# Altium project TennisButler.PrjPcb (part 1 of 2)
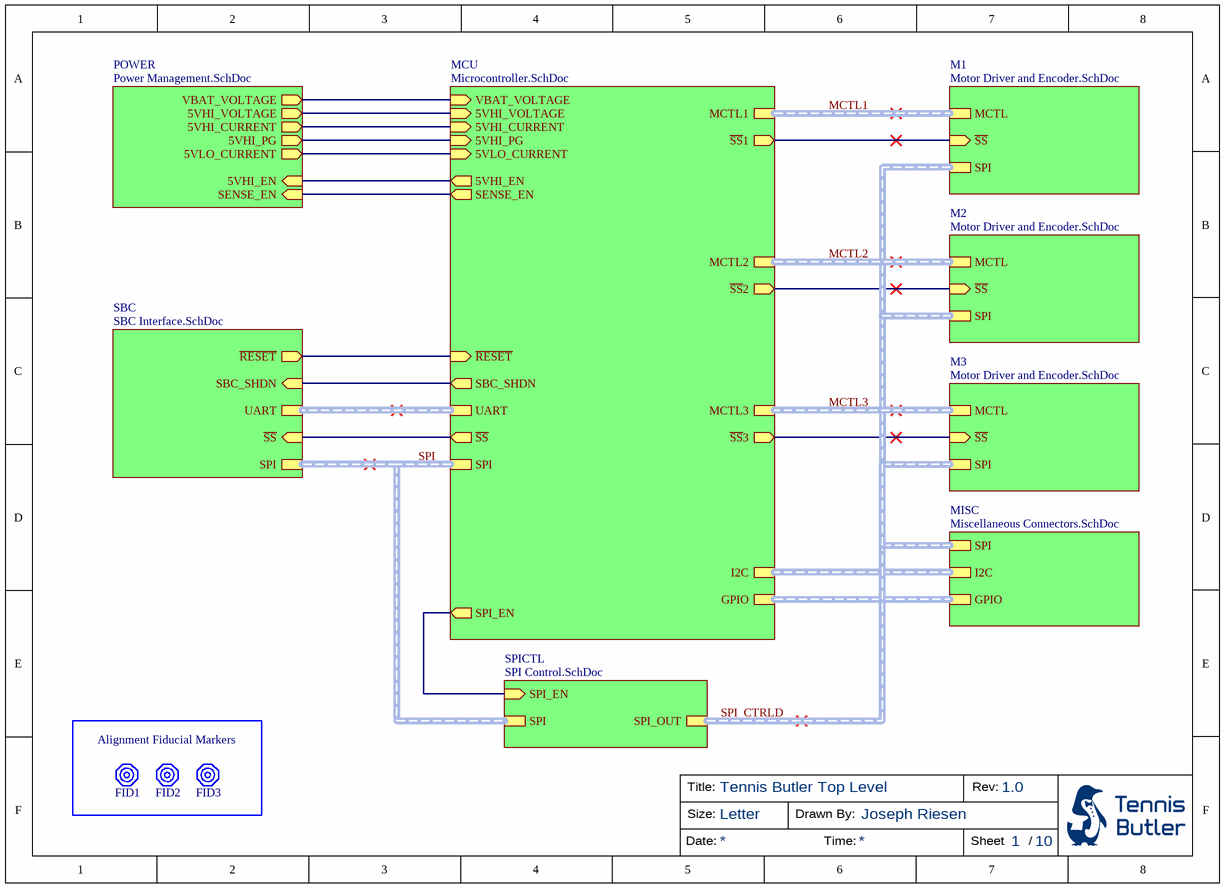
[diagram p0: Tennis Butler V1.0.SchDoc]
10 sheets, 98 parts. Net scope: hierarchical (ports join the sheet entries above them; power ports are global).
Board file: TennisButler PCB.PcbDoc
Sheets:
  Tennis Butler V1.0.SchDoc
    M1 = Motor Driver and Encoder.SchDoc
    POWER = Power Management.SchDoc
      HI = High-Current Power Supply.SchDoc
      LO = Low-Current Power Supply.SchDoc
    MCU = Microcontroller.SchDoc
      MCU_SUPPORT = Microcontroller Support.SchDoc
    M2 = Motor Driver and Encoder.SchDoc
    M3 = Motor Driver and Encoder.SchDoc
    SBC = SBC Interface.SchDoc
    MISC = Miscellaneous Connectors.SchDoc
    SPICTL = SPI Control.SchDoc

## Sheet Tennis Butler V1.0.SchDoc: Tennis Butler Top Level
size 228 x 165 mm; DrawnBy: Joseph Riesen; DocumentNumber: 1; Revision: 1.0; SheetNumber: 1; SheetTotal: 10

### Parts
FID1  Fiducial, Global  [Fiducial, Global]  (value not drawn)  (no BOM)
FID2  Fiducial, Global  [Fiducial, Global]  (value not drawn)  (no BOM)
FID3  Fiducial, Global  [Fiducial, Global]  (value not drawn)  (no BOM)

### Blocks framed on the sheet
Alignment Fiducial Markers: FID1-FID3

### Sub-sheets
M1 = Motor Driver and Encoder.SchDoc: ~{SS} (in), SPI (harness SPI), MCTL (harness Motor Control)
M2 = Motor Driver and Encoder.SchDoc: ~{SS} (in), SPI (harness SPI), MCTL (harness Motor Control)
M3 = Motor Driver and Encoder.SchDoc: ~{SS} (in), SPI (harness SPI), MCTL (harness Motor Control)
MCU = Microcontroller.SchDoc: SPI (harness SPI), UART (harness UART), ~{RESET} (in), MCTL3 (harness Motor Control), MCTL2 (harness Motor Control), MCTL1 (harness Motor Control), ~{SS}3 (out), ~{SS}2 (out), ~{SS}1 (out), VBAT_VOLTAGE (in), 5VLO_CURRENT (in), 5VHI_CURRENT (in), SENSE_EN (out), 5VHI_EN (out), 5VHI_PG (in), I2C (harness I2C), SBC_SHDN (out), GPIO (harness GPIO), ~{SS} (out), SPI_EN (out), 5VHI_VOLTAGE (in)
MISC = Miscellaneous Connectors.SchDoc: SPI (harness SPI), I2C (harness I2C), GPIO (harness GPIO)
POWER = Power Management.SchDoc: 5VHI_EN (in), SENSE_EN (in), VBAT_VOLTAGE (out), 5VHI_PG (out), 5VLO_CURRENT (out), 5VHI_CURRENT (out), 5VHI_VOLTAGE (out)
SBC = SBC Interface.SchDoc: UART (harness UART), ~{RESET} (out), ~{SS} (in), SPI (harness SPI), SBC_SHDN (in)
SPICTL = SPI Control.SchDoc: SPI_EN (in), SPI_OUT (harness SPI), SPI (harness SPI)

### Nets
5VHI_CURRENT: sheet POWER/5VHI_CURRENT, sheet MCU/5VHI_CURRENT
5VHI_EN: sheet POWER/5VHI_EN, sheet MCU/5VHI_EN
5VHI_PG: sheet POWER/5VHI_PG, sheet MCU/5VHI_PG
5VHI_VOLTAGE: sheet POWER/5VHI_VOLTAGE, sheet MCU/5VHI_VOLTAGE
5VLO_CURRENT: sheet POWER/5VLO_CURRENT, sheet MCU/5VLO_CURRENT
~{OE}: sheet MCU/SPI_EN, sheet SPICTL/SPI_EN
~{RESET}: sheet MCU/~{RESET}, sheet SBC/~{RESET}
~{SS}: sheet MCU/~{SS}, sheet SBC/~{SS}
~{SS}1: sheet M1/~{SS}, sheet MCU/~{SS}1
~{SS}2: sheet MCU/~{SS}2, sheet M2/~{SS}
~{SS}3: sheet MCU/~{SS}3, sheet M3/~{SS}
SBC_SHDN: sheet MCU/SBC_SHDN, sheet SBC/SBC_SHDN
SENSE_EN: sheet POWER/SENSE_EN, sheet MCU/SENSE_EN
VBAT_VOLTAGE: sheet POWER/VBAT_VOLTAGE, sheet MCU/VBAT_VOLTAGE

### Buses and harness runs
harness MCTL1 = sheet M1/MCTL = sheet MCU/MCTL1
harness MCTL2 = sheet M2/MCTL = sheet MCU/MCTL2
harness MCTL3 = sheet M3/MCTL = sheet MCU/MCTL3
harness sheet MCU/GPIO = sheet MISC/GPIO
harness sheet MCU/I2C = sheet MISC/I2C
harness sheet MCU/UART = sheet SBC/UART
harness SPI = sheet MCU/SPI = sheet SBC/SPI = sheet SPICTL/SPI
harness SPI_CTRLD = sheet M1/SPI = sheet M2/SPI = sheet M3/SPI = sheet MISC/SPI = sheet SPICTL/SPI_OUT

### Notes on the sheet
- Title:
- Size:
- Letter
- Drawn By:
- Rev:
- Date:
- Time:
- Sheet
- /

## Sheet Motor Driver and Encoder.SchDoc: Motor Driver and Encoder Counter
size 228 x 165 mm; DrawnBy: Joseph Riesen; DocumentNumber: 7; Revision: 1.0; SheetNumber: 7; SheetTotal: 10
Used 3 times, as channels M1, M2, M3. Parts and nets are listed once, with the designators drawn on the sheet.
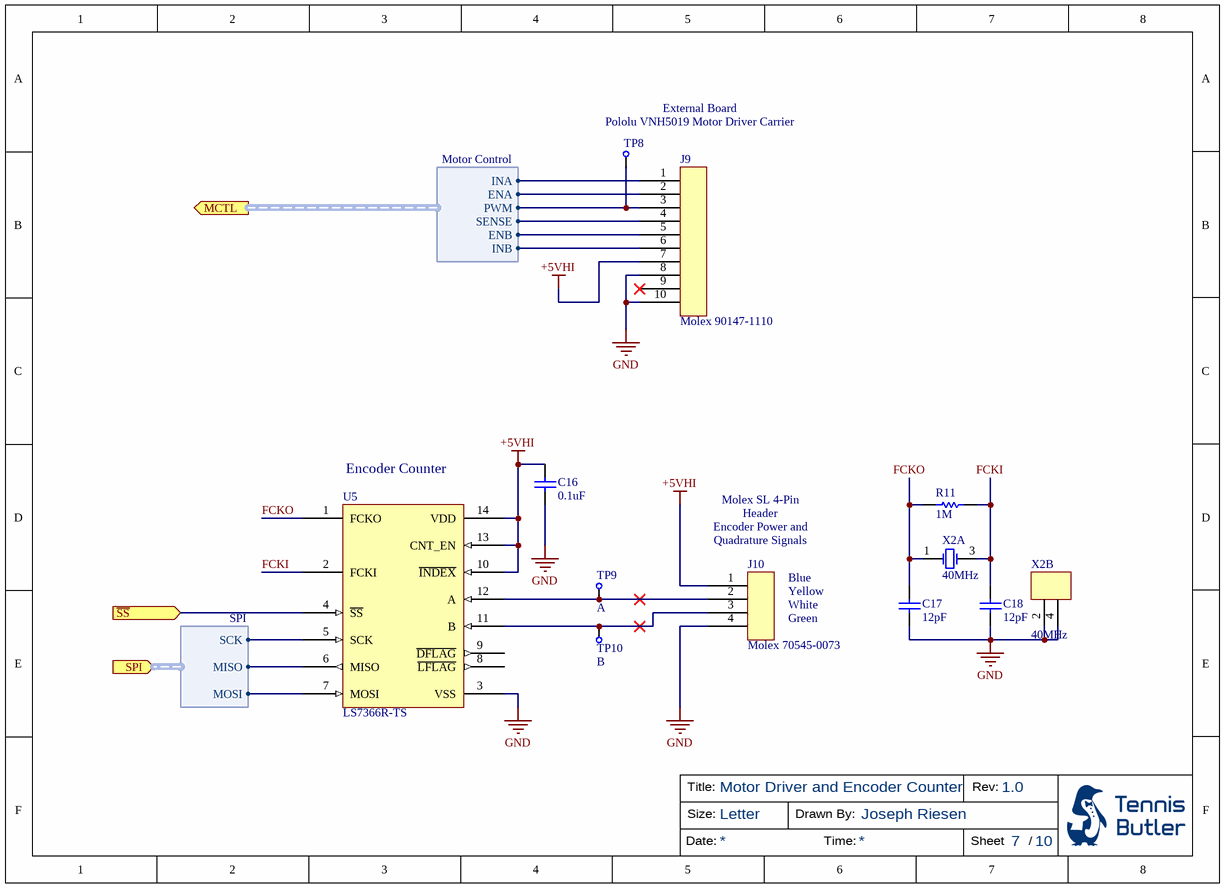
[diagram p1: Motor Driver and Encoder.SchDoc]

### Parts
C16  0.1uF  [CAPC0805(2012)100_M]
C17  12pF  [CAPC1608X87X35ML15T15]
C18  12pF  [CAPC1608X87X35ML15T15]
J9  Molex 90147-1110  [Molex 90147-1110]
J10  Molex 70545-0073  [Molex 70545-0073]
R11  1M  [RESC2013X70X40NL20T20]
TP8  PWM  [Test Point]  (value not drawn)  (no BOM)
TP9  A  [Test Point]  (no BOM)
TP10  B  [Test Point]  (no BOM)
U5  LS7366R-TS  [TSOP65P640X110-14M]
X2  40MHz  [DFN220P320X80-4M]  (parts A,B of 2)

### Ports
MCTL (out, harness Motor Control), SPI (in, harness SPI), ~{SS} (in)

### Harnesses
SPI: MISO, MOSI, SCK
Motor Control: ENA, ENB, INA, INB, PWM, SENSE

### Nets
+5VHI: C16.2 J9.7 J10.1 U5.10(~{INDEX}) U5.13(CNT_EN) U5.14(VDD)
GND: C16.1 C17.1 C18.1 J9.8 J9.10 J10.4 U5.3(VSS) X2.2(GND) X2.4(GND)
FCKI: C18.2 R11.1 U5.2(FCKI) X2.3(X2)
FCKO: C17.2 R11.2 U5.1(FCKO) X2.1(X1)
~{SS}: U5.4(~{SS}) ; port ~{SS}
NetJ9_1: J9.1 ; port MCTL.INA
NetJ9_2: J9.2 ; port MCTL.ENA
NetJ9_3: J9.3 TP8.1 ; port MCTL.PWM
NetJ9_4: J9.4 ; port MCTL.SENSE
NetJ9_5: J9.5 ; port MCTL.ENB
NetJ9_6: J9.6 ; port MCTL.INB
NetJ10_2: J10.2 TP9.1 U5.12(A)
NetJ10_3: J10.3 TP10.1 U5.11(B)
NetU5_5: U5.5(SCK) ; port SPI.SCK
NetU5_6: U5.6(MISO) ; port SPI.MISO
NetU5_7: U5.7(MOSI) ; port SPI.MOSI

Not connected (* = marked no-connect by the designer): J9 9*; U5 8(~{LFLAG}) 9(~{DFLAG})

### Channels
M1: designators end in _M1; ports ~{SS}=~{SS}1
M2: designators end in _M2; ports ~{SS}=~{SS}2
M3: designators end in _M3; ports ~{SS}=~{SS}3

### Notes on the sheet
- (near TP8) External Board
  Pololu VNH5019 Motor Driver Carrier
- (near U5) Encoder Counter
- (near J10) Molex SL 4-Pin Header
  Encoder Power and Quadrature Signals
- (near J10) Blue
- (near J10) Yellow
- (near J10) White
- (near J10) Green
- Title:
- Size:
- Letter
- Drawn By:
- Rev:
- Date:
- Time:
- Sheet
- /

### Library data of the parts
C16 = CMP-1036-04391-1: CAP 100nF 6.3V ±10% 0805 (2012 Metric) Thickness 1mm SMD; Case-EIA: 0805; Case-Metric: 2012; Tolerance: Â±10%; Rated Voltage: 6.3 V; Technology: SMT; Value: 100nF; Max Thickness: 1 mm
C17 C18 = CMP-2006-03475-1: Manufacturer: Kemet; Part Number: C0603C120C5GACTU
J9 = Molex 90147-1110 C-Grid 10-Pin Header: C-Grid® PC Board Connector, Single Row, Vertical, 10 Circuits, Tin (Sn) Plating; Number of Positions: 10; Current Rating: 3A; Voltage Rating: 350V; Pitch: 2.54mm; Glow Wire Compliant: Non-compliant; Supplier 1: Digikey; Manufacturer: Molex; Manufacturer Part Number: 90147-1110; Stock 1: 2940; Pricing 1: 1 = 2.53000, 10 = 2.29800, 25 = 2.15760, 50 = 2.06380, 100 = 1.97000, 250 = 1.78240, 500 = 1.64168, 1760 = 1.36024, 3520 = 1.31334 (USD); RoHS 1: Yes; Mount: Through Hole; Contact Plating: Tin; Contact Material: Bronze; Housing Material: Polyester; Material: Bronze; Min Operating Temperature: -55°C; Max Operating Temperature: 125°C; Number of Rows: 1; Packaging: Rail/Tube; Number of Contacts: 10; Termination: Solder; Orientation: Vertical; Package Quantity: 1760; Number of Circuits: 10; Radiation Hardening: No; Flammability Rating: UL94 V-0; ComponentLink1URL: https://datasheet.ciiva.com/16732/0901471110-pcb-receptacles-16732368.pdf?src-supplier=Avnet+Europe; ComponentLink1Description: Datasheet 1 (Avnet Europe); ComponentLink2URL: https://datasheet.ciiva.com/30193/276430901471110-pcb-receptacles-30193986.pdf?src-supplier=Onlinecomponents.com; ComponentLink2Description: Datasheet 3 (Mouser); ComponentLink3URL: https://datasheet.ciiva.com/5158/0901471110-pcb-receptacles-176767-5158986.pdf?src-supplier=Mouser; ComponentLink3Description: Datasheet 4 (Avnet); ComponentLink4URL: https://datasheet.ciiva.com/10082/0901471110-pcb-receptacles-10082332.pdf?src-supplier=Avnet; ComponentLink4Description: Datasheet 2 (Onlinecomponents.com); Supplier Part Number 1: WM3630-ND
J10 = Molex 70545-0073 SL 4-Pin Header: CONN HEADER VERT 4POS 2.54MM, PEG; Contact Resistance: 30mR; Number of Positions: 4; Current Rating: 3A; Voltage Rating: 250V; Insulation Resistance: 1GR; Glow Wire Compliant: Non-compliant; ComponentLink1Description: Drawing; ComponentLink1URL: https://www.molex.com/pdm_docs/sd/705450073_sd.pdf; Supplier 1: Digikey; Manufacturer: Molex; Manufacturer Part Number: 70545-0073; Stock 1: 705; Pricing 1: 1 = 1.55000, 10 = 1.41000, 100 = 1.20860, 500 = 1.00712, 1440 = 0.86325, 5760 = 0.76541, 10080 = 0.74815 (USD); RoHS 1: Yes; Mount: Through Hole; Contact Plating: Gold; Contact Material: Bronze; Housing Material: Polycyclohexylenedimethylene; Color: Black; Material: Brass; Min Operating Temperature: -40°C; Max Operating Temperature: 105°C; Number of Rows: 1; Packaging: Rail/Tube; Package Quantity: 1440; Termination: Through Hole; Orientation: Vertical; Number of Contacts: 4; Voltage Rating (DC): 250V; Number of Circuits: 4; Pitch: 2.54mm; Flammability Rating: UL94 V-0; ELV: Compliant; Supplier Part Number 1: WM12791-ND
R11 = CMP-1665-00012-4: Chip Resistor, 1000 KOhm, +/- 1%, 0.125 W, -55 to 155 degC, 0805 (2012 Metric), RoHS, Tape and Reel; Manufacturer: Panasonic; Voltage Rating: 150 V; ComponentLink2URL: http://industrial.panasonic.com/cdbs/www-data/pdf/RDA0000/AOA0000C86.pdf; PackageReference: 0805; Min Operating Temperature: -55 degC; RoHSCompliant: true; Package Quantity: 5000; ComponentLink1URL: http://www.panasonic.com/; Pins: 2; Height: 0.6 mm; Packaging: Tape and Reel; ComponentLink2Description: Datasheet; ComponentLink1Description: Manufacturer URL; Mounting Technology: Surface Mount; REACH SVHC: Yes; Mount: Surface Mount; PackageDescription: 2-Pin Surface Mount Device, Body 2 x 1.25 mm; DatasheetVersion: 04/2015; Max Operating Temperature: 155 degC; Length: 2 mm
TP8-TP10 = Test Point
U5 = LS7366R-TS: 32-Bit Quadrature Clock Counter with Serial Interface; Manufacturer: LSI/CSI; Case/Package: TSSOP; Manufacturer Part Number: LS7366R-TS; ComponentLink1Description: Datasheet; ComponentLink1URL: https://lsicsi.com/datasheets/LS7366R.pdf; Number of Pins: 14; Packaging: Tray; Supplier 1: LSI/CSI; Supplier Part Number 1: LS7366R-TS; Stock 1: 10000; Lead Free: Lead Free; RoHS: Yes; Pricing 1: 1 = 3.96000, 25 = 3.16000, 100 = 2.51000, 500 = 2.01000, 1000 = 1.61000, 5000 = 1.37000, 10000 = 1.17000 (USD); ComponentLink2Description: Manufacturer's Website; ComponentLink2URL: https://lsicsi.com/#/products/Incremental-Encoder-Interface/LS7366R_LS7366R-S_LS7366R-TS
X2 = 603-40-48: CRYSTAL 40MHZ 12PF SMD; Manufacturer: Fox Electronics; Supplier 1: Digi-Key; Manufacturer Part Number: 603-40-48; Stock 1: 3916; Pricing 1: 1 = 0.840000, 10 = 0.744000, 50 = 0.695400, 100 = 0.614500, 500 = 0.582120, 1000 = 0.485100 (USD); RoHS 1: No; ComponentLink1URL: https://www.foxonline.com/pdfs/603-40-48.pdf?src-supplier=Digi-Key; ComponentLink1Description: Datasheet; Supplier Part Number 1: 631-1480-1-ND

## Sheet Power Management.SchDoc: Power Management
size 228 x 165 mm; DrawnBy: Joseph Riesen; DocumentNumber: 4; Revision: 1.0; SheetNumber: 4; SheetTotal: 10
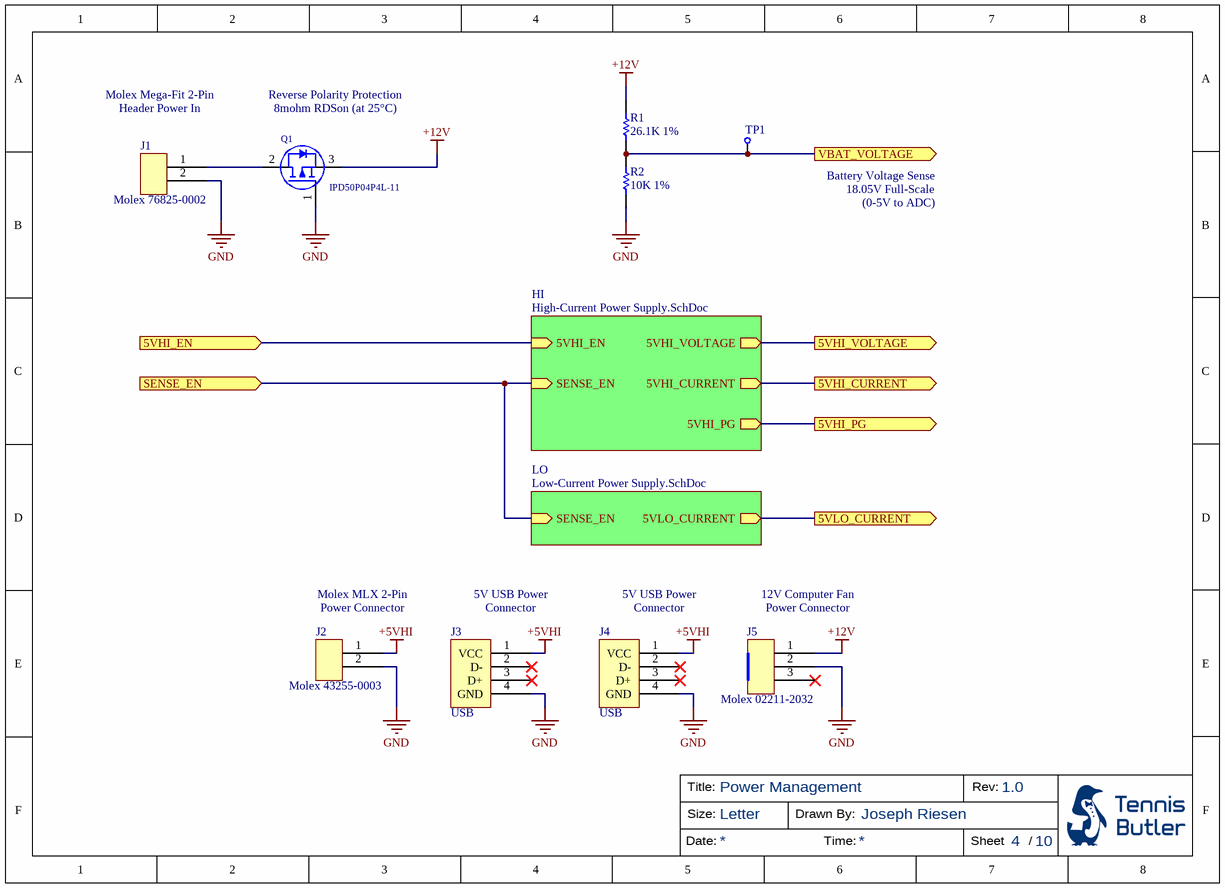
[diagram p2: Power Management.SchDoc]

### Parts
J1  Molex 76825-0002  [MOLEX 76825-0002]
J2  Molex 43255-0003  [Molex 43255-0003]
J3  USB  [Molex 105057-0001]
J4  USB  [Molex 105057-0001]
J5  Molex 02211-2032  [Molex 02211-2032]
Q1  IPD50P04P4L-11  [DPAK228P1000X235-3M]
R1  26.1K 1%  [RESC0805(2012)_M]
R2  10K 1%  [RESC2013X70X40ML20T20]
TP1  VBAT VOLTAGE  [Test Point]  (value not drawn)  (no BOM)

### Sub-sheets
HI = High-Current Power Supply.SchDoc: 5VHI_EN (in), 5VHI_CURRENT (out), SENSE_EN (in), 5VHI_PG (out), 5VHI_VOLTAGE (out)
LO = Low-Current Power Supply.SchDoc: 5VLO_CURRENT (out), SENSE_EN (in)

### Ports
5VHI_CURRENT (out), 5VHI_EN (in), 5VHI_PG (out), 5VHI_VOLTAGE (out), 5VLO_CURRENT (out), SENSE_EN (in), VBAT_VOLTAGE (out)

### Nets
+5VHI: J2.1 J3.1(VCC) J4.1(VCC)
+12V: J5.1 Q1.3 R1.2
GND: J1.2 J2.2 J3.4(GND) J4.4(GND) J5.2 Q1.1 R2.1
5VHI_CURRENT: port 5VHI_CURRENT, sheet HI/5VHI_CURRENT
5VHI_EN: port 5VHI_EN, sheet HI/5VHI_EN
5VHI_PG: port 5VHI_PG, sheet HI/5VHI_PG
5VHI_VOLTAGE: port 5VHI_VOLTAGE, sheet HI/5VHI_VOLTAGE
5VLO_CURRENT: port 5VLO_CURRENT, sheet LO/5VLO_CURRENT
SENSE_EN: port SENSE_EN, sheet HI/SENSE_EN, sheet LO/SENSE_EN
VBAT_VOLTAGE: R1.1 R2.2 TP1.1 ; port VBAT_VOLTAGE
NetJ1_1: J1.1 Q1.2

Not connected (* = marked no-connect by the designer): J3 2(D-)* 3(D+)* 5(GND) 6(GND) 7(GND); J4 2(D-)* 3(D+)* 5(GND) 6(GND) 7(GND); J5 3*

### Notes on the sheet
- (near J1) Molex Mega-Fit 2-Pin
  Header Power In
- (near Q1) Reverse Polarity Protection
  8mohm RDSon (at 25°C)
- Battery Voltage Sense
  18.05V Full-Scale
  (0-5V to ADC)
- (near J2) Molex MLX 2-Pin Power Connector
- (near J3) 5V USB Power Connector
- (near J4) 5V USB Power Connector
- (near J5) 12V Computer Fan Power Connector
- Title:
- Size:
- Letter
- Drawn By:
- Rev:
- Date:
- Time:
- Sheet
- /

### Library data of the parts
J1 = Molex 76825-0002: CONN HEADER R/A 2POS; Number of Circuits: 2; Gender: Male; Pitch: 5.7mm; Supplier 1: Digi-Key; Manufacturer: Molex; Manufacturer Part Number: 76825-0002; Stock 1: 2541; Pricing 1: 1 = 1.13000, 10 = 0.99300, 25 = 0.93440, 50 = 0.89560, 100 = 0.85670, 250 = 0.77880, 500 = 0.70092, 2016 = 0.58410, 4032 = 0.56463 (USD); RoHS: Yes; Color: Black; Contact Plating: Tin; Contact Material: Copper; Termination: Through Hole; Number of Rows: 2; Orientation: Right Angle; Number of Contacts: 2; REACH SVHC: Unknown; ComponentLink1URL: http://www.farnell.com/datasheets/2216551.pdf?src-supplier=Farnell; ComponentLink1Description: Datasheet 1 (Farnell); ComponentLink2URL: http://www.alliedelec.com/images/products/datasheets/bm/BrandonData/70717238.pdf?src-supplier=Allied+Electronics; ComponentLink2Description: Datasheet 2 (Allied Electronics); ComponentLink3URL: https://www.molex.com/pdm_docs/sd/768250002_sd.pdf?src-supplier=Digi-Key; ComponentLink3Description: Datasheet 3 (Digi-Key); ComponentLink4URL: http://www.farnell.com/datasheets/2001779.pdf?src-supplier=Element14; ComponentLink4Description: Datasheet 4 (Element14); ComponentLink5URL: http://www.farnell.com/datasheets/1968956.pdf?src-supplier=Element14; ComponentLink5Description: Datasheet 5 (Element14); Supplier Part Number 1: WM11969-ND
J2 = Molex 43255-0003: Pin & Socket Connectors 0.084 MLX Hdr 2CKT WITH PEG; Current Rating: 20A; Voltage Rating: 600V; Number of Positions: 2; Pitch: 6.35mm; Glow Wire Compliant: Non-compliant; Supplier 1: Digi-Key; Manufacturer: Molex; Manufacturer Part Number: 43255-0003; Stock 1: 7344; Pricing 1: 1 = 0.46000, 10 = 0.43200, 100 = 0.33140, 500 = 0.28820, 1836 = 0.23056, 5508 = 0.20895, 11016 = 0.19454 (USD); RoHS 1: Yes; Mount: Through Hole; Contact Material: Bronze; Contact Plating: Tin; Housing Material: Polyester; Min Operating Temperature: -55°C; Max Operating Temperature: 105°C; Package Quantity: 1836; Number of Rows: 1; Contact Gender: Male; Packaging: Tray; Termination: Through Hole; Number of Contacts: 2; Orientation: Straight; Number of Circuits: 2; REACH SVHC: No SVHC; Flammability Rating: UL94 V-0; ComponentLink1URL: https://datasheet.ciiva.com/30153/7750432550003-pcb-headers-30153428.pdf?src-supplier=Onlinecomponents.com; ComponentLink1Description: Datasheet 1 (Onlinecomponents.com); ComponentLink2URL: https://datasheet.ciiva.com/12919/0432550003-pcb-headers-168374-12919417.pdf?src-supplier=Mouser; ComponentLink2Description: Datasheet 2 (Mouser); Supplier Part Number 1: WM23264-ND
J3 J4 = Molex 105057-0001: CONN RCPT USB2.0 TYPEA 4POS VERT; Manufacturer: Molex; Gender: Receptacle; Number of Ports: 1; Number of Contacts: 4; Current Rating: 1.5A; Voltage Rating: 30V; Pitch: 2mm; Supplier 1: Digi-Key; Manufacturer Part Number: 105057-0001; Stock 1: 43852; Pricing 1: 1 = 1.29000, 10 = 1.13600, 25 = 1.06880, 50 = 1.02440, 100 = 0.97990, 250 = 0.89080, 500 = 0.80172, 2016 = 0.66810, 4032 = 0.64583 (USD); RoHS 1: Yes; Mount: Through Hole; Contact Plating: Gold; Contact Material: Copper Alloy; Number of Terminals: 4; Housing Material: Thermoplastic; Color: Black; Min Operating Temperature: -40°C; Max Operating Temperature: 85°C; Packaging: Tray; Package Quantity: 2016; Connector Type: USB; Termination: Solder; Orientation: Vertical; Features: Shielded; Number of Positions: 4; Number of Circuits: 4; USB Standard: USB 2.0; Length: 14.68mm; Depth: 14.3mm; Radiation Hardening: No; REACH SVHC: Unknown; ComponentLink1URL: https://datasheet.ciiva.com/3094/1050570001-io-connectors-3094352.pdf?src-supplier=Avnet; ComponentLink1Description: https://datasheet.ciiva.com/3094/1050570001-io-connectors-3094352.pdf?src-supplier=Avnet; ComponentLink2URL: https://datasheet.ciiva.com/1098/1598467-1098017.pdf?src-supplier=Element14; ComponentLink2Description: https://datasheet.ciiva.com/1098/1598467-1098017.pdf?src-supplier=Element14; ComponentLink3URL: https://datasheet.ciiva.com/26290/1050570001-io-connectors-26290434.pdf?src-supplier=Onlinecomponents.com; ComponentLink3Description: https://datasheet.ciiva.com/26290/1050570001-io-connectors-26290434.pdf?src-supplier=Onlinecomponents.com; ComponentLink4URL: https://datasheet.ciiva.com/16142/539171050570001-io-nectors-16142942.pdf?src-supplier=Onlinecomponents.com; ComponentLink4Description: https://datasheet.ciiva.com/16142/539171050570001-io-nectors-16142942.pdf?src-supplier=Onlinecomponents.com; ComponentLink5URL: https://datasheet.ciiva.com/15181/getdatasheetpartid-152694-15181206.pdf?src-supplier=Verical; ComponentLink5Description: https://datasheet.ciiva.com/15181/getdatasheetpartid-152694-15181206.pdf?src-supplier=Verical; Supplier Part Number 1: WM8672-ND
J5 = Molex 02211-2032 KK254 3-Pin Polarized Male Header: KK® 254 Solid Header, Vertical, with Friction Lock, 3 Circuits, Gold (Au) Plating; Contact Resistance: 10mR; Number of Positions: 3; Current Rating: 4A; Voltage Rating: 250V; Gender: Male; Insulation Resistance: 50GR; Pitch: 2.54mm; Approvals: UL; Glow Wire Compliant: Non-compliant; Supplier 1: Digi-Key; Manufacturer: Molex; Manufacturer Part Number: 22-11-2032; Stock 1: 54741; Pricing 1: 1 = 0.56000, 10 = 0.52700, 100 = 0.40370, 500 = 0.35100, 1000 = 0.28958, 5000 = 0.25448, 10000 = 0.23693 (USD); RoHS 1: Yes; Mount: Through Hole; Contact Plating: Gold; Contact Material: Brass; Color: White; Housing Color: Black; Housing Material: Nylon; Min Operating Temperature: 0°C; Max Operating Temperature: 75°C; Number of Rows: 1; Packaging: Bulk; Termination: Through Hole; Number of Contacts: 3; Orientation: Straight; Package Quantity: 2000; Max Current Rating: 4A; Number of Circuits: 3; Voltage Rating (DC): 250V; Length: 95mm; Height: 14.68mm; Depth: 9.02mm; Radiation Hardening: No; REACH SVHC: Unknown; Halogen Free: Low Halogen; Lead Free: Lead Free; Flammability Rating: UL94 V-0; ComponentLink1URL: https://datasheet.ciiva.com/5159/0022112032-pcb-headers-158580-5159152.pdf?src-supplier=Mouser; ComponentLink1Description: Datasheet 1 (Mouser); ComponentLink2URL: https://datasheet.ciiva.com/30220/211850022112032-pcb-headers-30220272.pdf?src-supplier=Onlinecomponents.com; ComponentLink2Description: Datasheet 2 (Onlinecomponents.com); ComponentLink3URL: https://datasheet.ciiva.com/16656/0022112032-pcb-headers-16656147.pdf?src-supplier=Avnet+Europe; ComponentLink3Description: Datasheet 3 (Avnet Europe); ComponentLink4URL: https://datasheet.ciiva.com/19462/1966000-19462324.pdf?src-supplier=Jameco; ComponentLink4Description: Datasheet 4 (Jameco); ComponentLink5URL: https://datasheet.ciiva.com/19462/233592-19462460.pdf?src-supplier=Jameco; ComponentLink5Description: Datasheet 5 (Jameco); ComponentLink6URL: https://datasheet.ciiva.com/11746/0900766b80d8f3a3-11746606.pdf?src-supplier=RSComponents; ComponentLink6Description: Datasheet 6 (RSComponents); ComponentLink7URL: https://datasheet.ciiva.com/10090/0022112032-pcb-headers-10090022.pdf?src-supplier=Avnet; ComponentLink7Description: Datasheet 7 (Avnet); ComponentLink8URL: https://datasheet.ciiva.com/28632/1928036-28632682.pdf?src-supplier=Element14; ComponentLink8Description: Datasheet 8 (Element14); Supplier Part Number 1: WM2701-ND
Q1 = IPD50P04P4L-11: MOSFET P-CH 40V 50A TO252-3; Manufacturer: Infineon; Rise Time: 9ns; Drain to Source Voltage (Vdss): -40V; Turn-On Delay Time: 12ns; Turn-Off Delay Time: 46ns; Fall Time: 39ns; Gate to Source Voltage (Vgs): 16V; Input Capacitance: 3.9nF; Rds On Max: 10.6mR; Max Power Dissipation: 58W; Drain to Source Resistance: 17.2mR; Element Configuration: Single; Supplier 1: Digi-Key; Manufacturer Part Number: IPD50P04P4L-11; Stock 1: 23273; Pricing 1: 1 = 1.10000, 10 = 0.97700, 100 = 0.77250, 500 = 0.59910, 1000 = 0.47297 (USD); RoHS 1: Yes; Case/Package: TO-252-3; Number of Pins: 3; Min Operating Temperature: -55°C; Max Operating Temperature: 175°C; Continuous Drain Current (ID): 50A; Package Quantity: 1; Packaging: Tape and Reel; Max Dual Supply Voltage: -40V; Length: 6.5mm; Height: 2.3mm; Width: 6.22mm; Halogen Free: Halogen Free; Lead Free: Lead Free; REACH SVHC: No SVHC; ComponentLink1URL: https://datasheet.ciiva.com/6379/infineon-ipd50p04p4l-11-ds-v01-00-en-6379847.pdf?src-supplier=Digi-Key; ComponentLink1Description: https://datasheet.ciiva.com/6379/infineon-ipd50p04p4l-11-ds-v01-00-en-6379847.pdf?src-supplier=Digi-Key; Supplier Part Number 1: IPD50P04P4L11ATMA1CT-ND
R1 = CMP-1013-00668-1: RES SMD 26.1K OHM 1% 1/8W 0805; Case-Metric: 2012; Power: 0.125 W; Value: 26100.00 Ohm; Case-EIA: 0805; Tolerance: 1 %; Technology: SMT
R2 = CMP-2001-04376-1: RES SMD 10K OHM 1% 1/8W 0805; Manufacturer: Panasonic; Part Number: ERJ-6ENF1002V
TP1 = Test Point

## Sheet High-Current Power Supply.SchDoc: High-Current Power Supply
size 228 x 165 mm; DrawnBy: Joseph Riesen; DocumentNumber: 6; Revision: 1.0; SheetNumber: 6; SheetTotal: 10
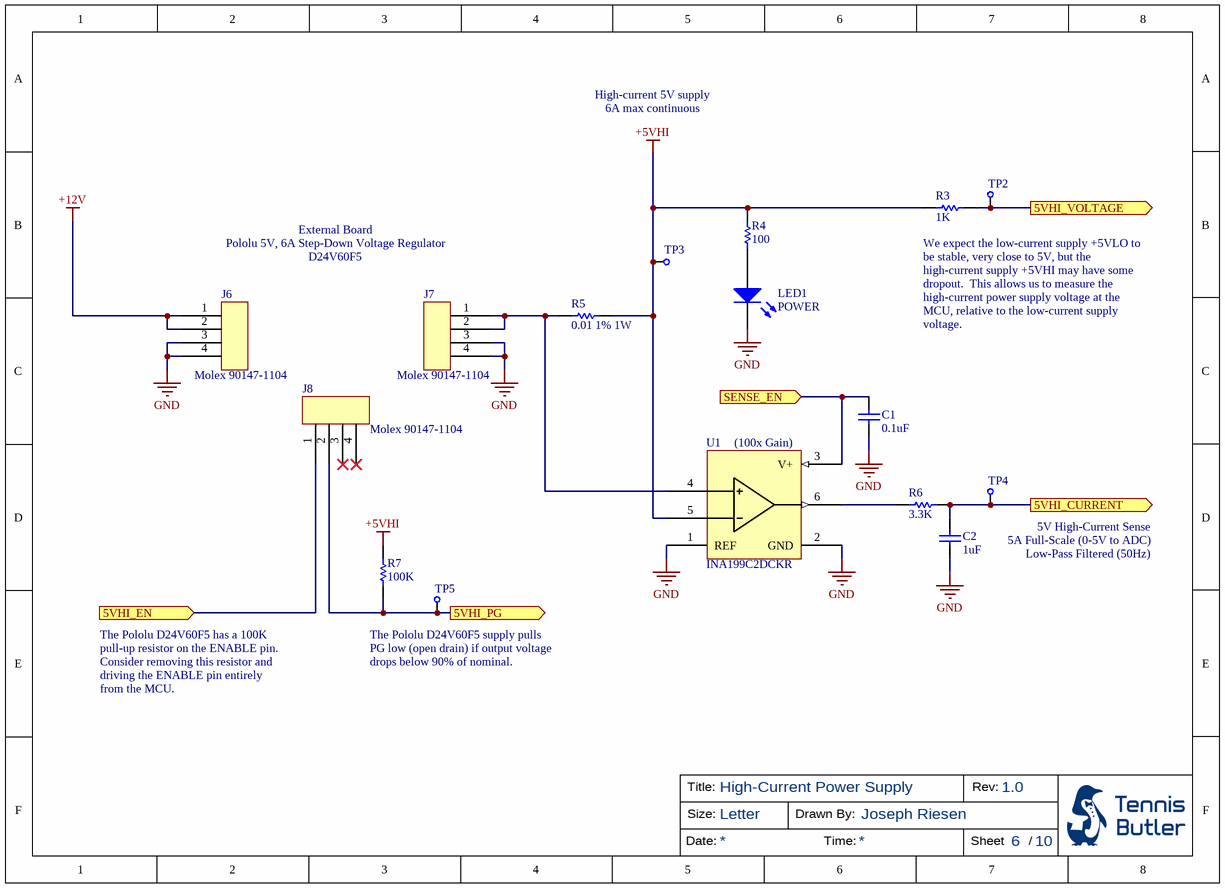
[diagram p3: High-Current Power Supply.SchDoc]

### Parts
C1  0.1uF  [CAPC0805(2012)100_M]
C2  1uF  [CAPC2013X100X50ML20T25]
J6  Molex 90147-1104  [Molex 90147-1104]
J7  Molex 90147-1104  [Molex 90147-1104]
J8  Molex 90147-1104  [Molex 90147-1104]
LED1  POWER  [0805_A]
R3  1K  [RESC2013X70X40ML20T20]
R4  100  [RESC2013X70X40ML20T20]
R5  0.01 1% 1W  [RESC3216X70X50NL05T20]
R6  3.3K  [RESC2013X70X40ML20T20]
R7  100K  [RESC2013X70X40ML20T20]
TP2  5VHI VSENSE  [Test Point]  (value not drawn)  (no BOM)
TP3  +5VHI  [Test Point]  (value not drawn)  (no BOM)
TP4  5VHI CSENSE  [Test Point]  (value not drawn)  (no BOM)
TP5  5VHI PG  [Test Point]  (value not drawn)  (no BOM)
U1  INA199C2DCKR  [TSOP65P240X110-6M]

### Ports
5VHI_CURRENT (out), 5VHI_EN (in), 5VHI_PG (out), 5VHI_VOLTAGE (out), SENSE_EN (in)

### Nets
+5VHI: R3.1 R4.2 R5.2 R7.2 TP3.1 U1.5(IN-)
+12V: J6.1 J6.2
GND: C1.1 C2.1 J6.3 J6.4 J7.3 J7.4 LED1.1(K) U1.1(REF) U1.2(GND)
5VHI_CURRENT: C2.2 R6.2 TP4.1 ; port 5VHI_CURRENT
5VHI_EN: J8.1 ; port 5VHI_EN
5VHI_PG: J8.2 R7.1 TP5.1 ; port 5VHI_PG
5VHI_VOLTAGE: R3.2 TP2.1 ; port 5VHI_VOLTAGE
SENSE_EN: C1.2 U1.3(V+) ; port SENSE_EN
NetJ7_1: J7.1 J7.2 R5.1 U1.4(IN+)
NetLED1_2: LED1.2(A) R4.1
NetR6_1: R6.1 U1.6(OUT)

Not connected (* = marked no-connect by the designer): J8 3* 4*

### Notes on the sheet
- High-current 5V supply
  6A max continuous
- External Board
  Pololu 5V, 6A Step-Down Voltage Regulator
  D24V60F5
- We expect the low-current supply +5VLO to be stable, very close to 5V, but the high-current supply +5VHI may have some dropout.  This allows us to measure the high-current power supply voltage at the MCU, relative to the low-current supply voltage.
- (near U1) (100x Gain)
- 5V High-Current Sense
  5A Full-Scale (0-5V to ADC)
  Low-Pass Filtered (50Hz)
- The Pololu D24V60F5 has a 100K pull-up resistor on the ENABLE pin.  Consider removing this resistor and driving the ENABLE pin entirely from the MCU.
- The Pololu D24V60F5 supply pulls PG low (open drain) if output voltage drops below 90% of nominal.
- Title:
- Size:
- Letter
- Drawn By:
- Rev:
- Date:
- Time:
- Sheet
- /

### Library data of the parts
C1 = CMP-1036-04391-1: as C16 on sheet Motor Driver and Encoder; Rated Voltage: 6.3 V; Technology: SMT; Value: 100nF; Max Thickness: 1 mm
C2 = CMP-2007-03677-1: Manufacturer: Kemet; Part Number: C0805C105K9RACTU
J6-J8 = Molex 90147-1104 C-Grid 4-Pin Header: C-Grid® PC Board Connector, Single Row, Vertical, 4 Circuits, Tin (Sn) Plating; Number of Positions: 4; Current Rating: 3A; Voltage Rating: 350V; Gender: Female; Pitch: 2.54mm; Glow Wire Compliant: Non-compliant; Supplier 1: Digi-Key; Manufacturer: Molex; Manufacturer Part Number: 90147-1104; Stock 1: 11420; Pricing 1: 1 = 1.24000, 10 = 1.08800, 100 = 0.93830, 500 = 0.76770, 4160 = 0.61843, 8320 = 0.56725, 12480 = 0.55445 (USD); RoHS 1: Yes; Contact Plating: Tin; Contact Material: Bronze; Housing Material: Polyester; Material: Bronze; Number of Rows: 1; Package Quantity: 4160; Packaging: Rail/Tube; Termination: Through Hole; Number of Contacts: 4; Orientation: Vertical; Number of Circuits: 4; Radiation Hardening: No; REACH SVHC: Unknown; Flammability Rating: UL94 V-0; ComponentLink1URL: https://datasheet.ciiva.com/13565/0901471104-pcb-receptacles-176839-13565807.pdf?src-supplier=Mouser; ComponentLink1Description: Datasheet 1 (Mouser); ComponentLink2URL: https://datasheet.ciiva.com/46431/1597377-46431813.pdf?src-supplier=Element14; ComponentLink2Description: Datasheet 2 (Element14); ComponentLink3URL: https://datasheet.ciiva.com/16733/0901471104-pcb-receptacles-16733373.pdf?src-supplier=Avnet+Europe; ComponentLink3Description: Datasheet 3 (Avnet Europe); ComponentLink4URL: https://datasheet.ciiva.com/10088/0901471104-pcb-receptacles-10088734.pdf?src-supplier=Avnet; ComponentLink4Description: Datasheet 4 (Avnet); ComponentLink5URL: https://datasheet.ciiva.com/16733/0901471104-pcb-receptacles-16733374.pdf?src-supplier=Avnet+Europe; ComponentLink5Description: Datasheet 5 (Avnet Europe); Supplier Part Number 1: WM14831-ND
LED1 = CMP-1426-00008-1: SMD mono-color Chip LED, WL-SMCW, Blue; Manufacturer: Wuerth Elektronik; PartNumber: 150080BS75000; Color: Blue; ComponentLink2URL: http://katalog.we-online.com/led/datasheet/150080BS75000.pdf; ComponentLink1URL: http://www.we-online.com; ComponentLink2Description: Datasheet; PackageReference: 0805_A; ComponentLink1Description: Manufacturer URL
R3 = CMP-2001-04375-1: RES SMD 1K OHM 1% 1/8W 0805; Part Number: ERJ-6ENF1001V; Manufacturer: Panasonic
R4 = CMP-1665-00009-4: Chip Resistor, 100 Ohm, +/- 1%, 0.125 W, -55 to 155 degC, 0805 (2012 Metric), RoHS, Tape and Reel; Manufacturer: Panasonic; Voltage Rating: 150 V; Height: 0.6 mm; RoHSCompliant: true; Min Operating Temperature: -55 degC; REACH SVHC: Yes; Package Quantity: 5000; ComponentLink2Description: Datasheet; ComponentLink1URL: http://www.panasonic.com/; Mount: Surface Mount; Max Operating Temperature: 155 degC; ComponentLink1Description: Manufacturer URL; Mounting Technology: Surface Mount; PackageReference: 0805; DatasheetVersion: 04/2015; Pins: 2; Length: 2 mm; Packaging: Tape and Reel; ComponentLink2URL: http://industrial.panasonic.com/cdbs/www-data/pdf/RDA0000/AOA0000C86.pdf; PackageDescription: 2-Pin Surface Mount Device, Body 2 x 1.25 mm
R5 = CMP-2003-00786-1: Part Number: ERJ8CWFR010V; Manufacturer: Panasonic
R6 = CMP-2001-00533-1: RES SMD 3.3K OHM 1% 1/8W 0805; Manufacturer: Panasonic; Part Number: ERJ6ENF3301V
R7 = CMP-2001-04377-1: RES SMD 100K OHM 1% 1/8W 0805; Part Number: ERJ-6ENF1003V; Manufacturer: Panasonic
TP2-TP5 = Test Point
U1 = INA199C2DCKR: IC OP AMP CURR SENSE SC70-6; Manufacturer: Texas Instruments; Supplier 1: Digi-Key; Manufacturer Part Number: INA199C2DCKR; Stock 1: 3000; Pricing 1: 1 = 0.90000, 10 = 0.80200, 100 = 0.62540, 500 = 0.51664, 1000 = 0.40788 (USD); RoHS 1: No; Min Operating Temperature: -40°C; Max Operating Temperature: 125°C; ComponentLink1URL: http://www.ti.com/lit/pdf/slyb194?src-supplier=Digi-Key; ComponentLink1Description: http://www.ti.com/lit/pdf/slyb194?src-supplier=Digi-Key; Supplier Part Number 1: 296-49644-1-ND

## Sheet Low-Current Power Supply.SchDoc: Low-Current Power Supply
size 228 x 165 mm; DrawnBy: Joseph Riesen; DocumentNumber: 5; Revision: 1.0; SheetNumber: 5; SheetTotal: 10
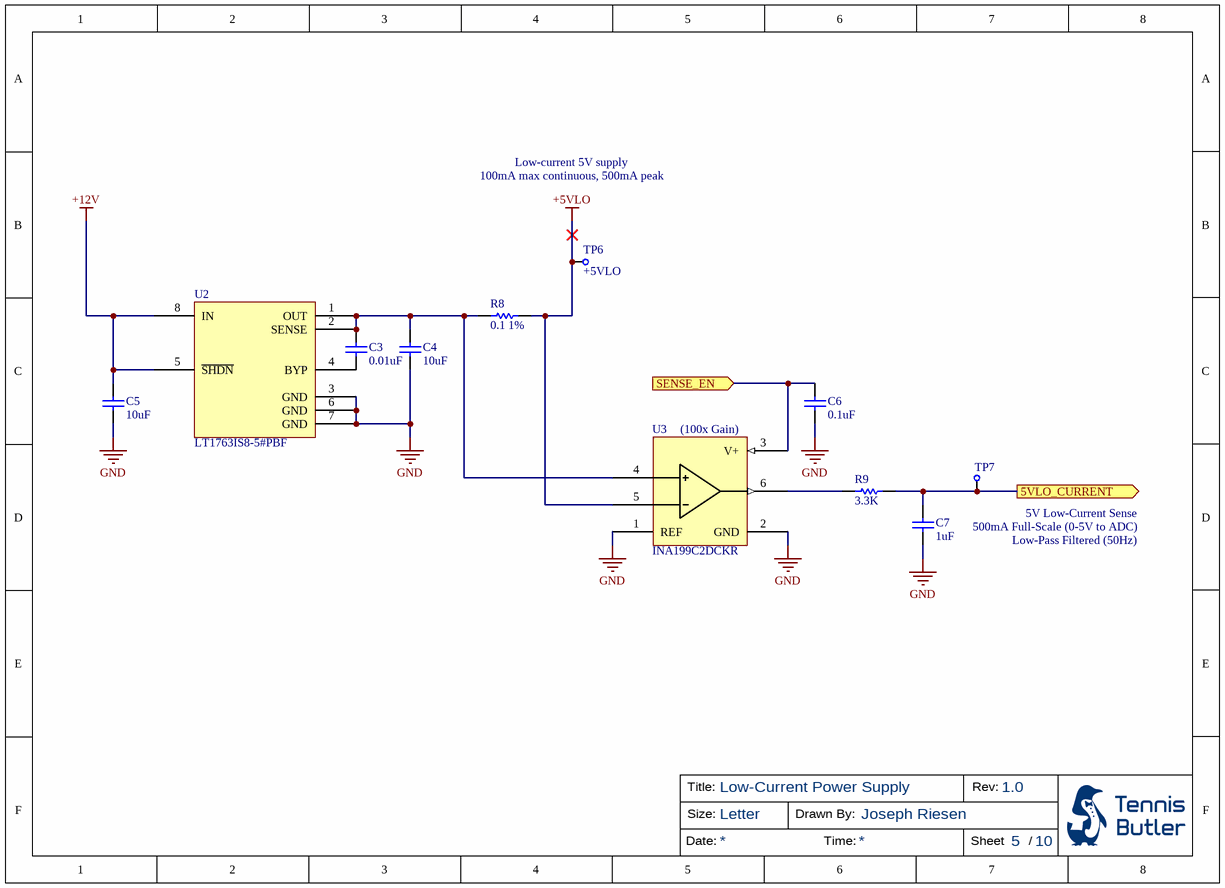
[diagram p4: Low-Current Power Supply.SchDoc]

### Parts
C3  0.01uF  [CAPC1608X87X35ML15T15]
C4  10uF  [CAPC2013X145X50ML20T25]
C5  10uF  [CAPC2013X145X50ML20T25]
C6  0.1uF  [CAPC0805(2012)100_M]
C7  1uF  [CAPC2013X100X50ML20T25]
R8  0.1 1%  [RESC3216X70X50NL05T20]
R9  3.3K  [RESC2013X70X40ML20T20]
TP6  +5VLO  [Test Point]  (no BOM)
TP7  5VLO CSENSE  [Test Point]  (value not drawn)  (no BOM)
U2  LT1763IS8-5#PBF  [SOIC127P600X175-8M]
U3  INA199C2DCKR  [TSOP65P240X110-6M]

### Ports
5VLO_CURRENT (out), SENSE_EN (in)

### Nets
+5VLO: R8.2 TP6.1 U3.5(IN-)
+12V: C5.2 U2.5(~{SHDN}) U2.8(IN)
GND: C4.1 C5.1 C6.1 C7.1 U2.3(GND) U2.6(GND) U2.7(GND) U3.1(REF) U3.2(GND)
5VLO_CURRENT: C7.2 R9.2 TP7.1 ; port 5VLO_CURRENT
SENSE_EN: C6.2 U3.3(V+) ; port SENSE_EN
NetC3_1: C3.1 U2.4(BYP)
NetC3_2: C3.2 C4.2 R8.1 U2.1(OUT) U2.2(SENSE) U3.4(IN+)
NetR9_1: R9.1 U3.6(OUT)

### Notes on the sheet
- Low-current 5V supply
  100mA max continuous, 500mA peak
- (near U3) (100x Gain)
- 5V Low-Current Sense
  500mA Full-Scale (0-5V to ADC)
  Low-Pass Filtered (50Hz)
- Title:
- Size:
- Letter
- Drawn By:
- Rev:
- Date:
- Time:
- Sheet
- /

### Library data of the parts
C3 = CMP-2006-03030-1: Manufacturer: Kemet; Part Number: C0603C103J3GACTU
C4 C5 = CMP-2007-01006-1: Manufacturer: Kemet; Part Number: C0805C106K9PACTU
C6 = CMP-1036-04391-1: as C16 on sheet Motor Driver and Encoder; Rated Voltage: 6.3 V; Technology: SMT; Value: 100nF; Max Thickness: 1 mm
C7 = CMP-2007-03677-1: as C2 on sheet High-Current Power Supply
R8 = CMP-2003-00708-1: Part Number: ERJ-L08KF10CV; Manufacturer: Panasonic
R9 = CMP-2001-00533-1: as R6 on sheet High-Current Power Supply
TP6 TP7 = Test Point
U2 = LT1763IS8-5#PBF: IC REG LINEAR 5V 500MA 8SOIC; Manufacturer: Analog Devices / Linear Technology; Dropout Voltage: 300mV; Number of Outputs: 1; Max Input Voltage: 20V; Min Input Voltage: 1.8V; Min Current Limit: 520mA; Polarity: Positive; Operating Supply Current: 30uA; Power Supply Rejection Ratio (PSRR): 65dB; Output Type: Fixed; Supplier 1: Digi-Key; Manufacturer Part Number: LT1763IS8-5#PBF; Stock 1: 1418; Pricing 1: 1 = 5.20000, 25 = 3.45400, 100 = 2.85600, 250 = 2.71320, 500 = 2.65200 (USD); RoHS 1: Yes; Case/Package: SOIC; Number of Pins: 8; Min Operating Temperature: -40°C; Max Operating Temperature: 125°C; Output Current: 500mA; Package Quantity: 100; Packaging: Rail/Tube; Output Voltage: 5V; Nominal Output Voltage: 5V; Number of Regulators: 1; REACH SVHC: No SVHC; ComponentLink1URL: https://datasheet.ciiva.com/22659/1599494-22659223.pdf?src-supplier=Farnell; ComponentLink1Description: Datasheet 2 (Farnell); ComponentLink2URL: https://datasheet.ciiva.com/2058/3903-2058730.pdf?src-supplier=Digi-Key; ComponentLink2Description: Datasheet 1 (Digi-Key); Supplier Part Number 1: LT1763IS8-5#PBF-ND
U3 = INA199C2DCKR: as U1 on sheet High-Current Power Supply; Supplier 1: Digi-Key; Manufacturer Part Number: INA199C2DCKR; Stock 1: 3000; Pricing 1: 1 = 0.90000, 10 = 0.80200, 100 = 0.62540, 500 = 0.51664, 1000 = 0.40788 (USD); RoHS 1: No; Min Operating Temperature: -40°C; Max Operating Temperature: 125°C; ComponentLink1URL: http://www.ti.com/lit/pdf/slyb194?src-supplier=Digi-Key; ComponentLink1Description: http://www.ti.com/lit/pdf/slyb194?src-supplier=Digi-Key; Supplier Part Number 1: 296-49644-1-ND

## Sheet Microcontroller.SchDoc: Microcontroller
size 228 x 165 mm; DrawnBy: Joseph Riesen; DocumentNumber: 2; Revision: 1.0; SheetNumber: 2; SheetTotal: 10
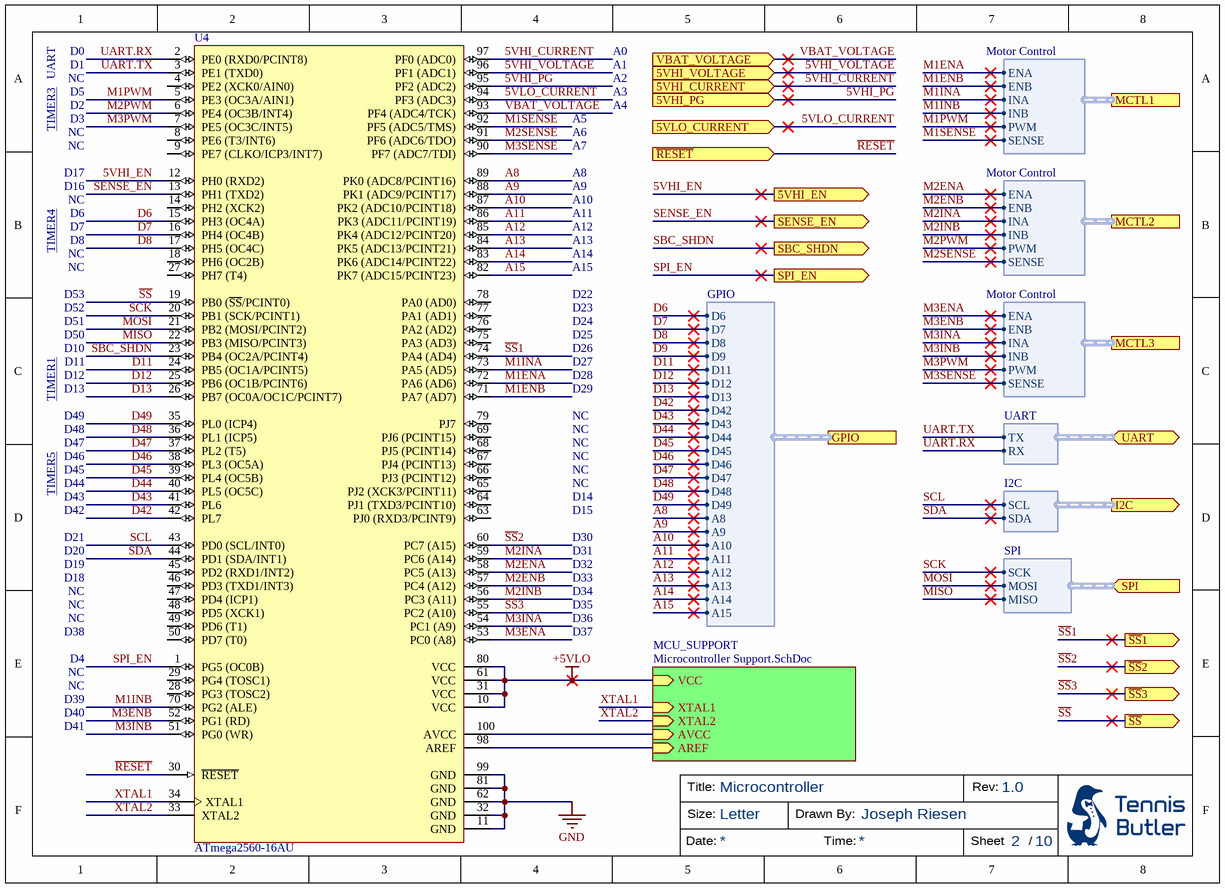
[diagram p5: Microcontroller.SchDoc]

### Parts
U4  ATmega2560-16AU  [TSQFP50P1600X1600X120-100M]

### Sub-sheets
MCU_SUPPORT = Microcontroller Support.SchDoc: XTAL2 (in), XTAL1 (in), AVCC (in), AREF (in), VCC (in)  | ComponentClassName: MCU

### Ports
5VHI_CURRENT (in), 5VHI_EN (out), 5VHI_PG (in), 5VHI_VOLTAGE (in), 5VLO_CURRENT (in), GPIO (harness GPIO), I2C (out, harness I2C), MCTL1 (harness Motor Control), MCTL2 (harness Motor Control), MCTL3 (harness Motor Control), SBC_SHDN (out), SENSE_EN (out), SPI (in, harness SPI), SPI_EN (out), UART (bidir, harness UART), VBAT_VOLTAGE (in), ~{RESET} (in), ~{SS}1 (out), ~{SS}2 (out), ~{SS}3 (out), ~{SS} (out)

### Harnesses
SPI: SCK, MOSI, MISO
UART: TX, RX
Motor Control: ENA, ENB, INA, INB, PWM, SENSE
I2C: SCL, SDA
GPIO: D7, D8, D9, D11, D12, D13, D42, D43, D44, D45, D46, D47, D48, D49, A8, A9, A10, A11, A12, A13, A14, A15, D6

### Nets
+5VLO: U4.10(VCC) U4.31(VCC) U4.61(VCC) U4.80(VCC) ; sheet MCU_SUPPORT/VCC
GND: U4.11(GND) U4.32(GND) U4.62(GND) U4.81(GND) U4.99(GND)
5VHI_CURRENT: U4.97(PF0_(ADC0)) ; port 5VHI_CURRENT
5VHI_EN: U4.12(PH0_(RXD2)) ; port 5VHI_EN
5VHI_PG: U4.95(PF2_(ADC2)) ; port 5VHI_PG
5VHI_VOLTAGE: U4.96(PF1_(ADC1)) ; port 5VHI_VOLTAGE
5VLO_CURRENT: U4.94(PF3_(ADC3)) ; port 5VLO_CURRENT
A8: U4.89(PK0_(ADC8/PCINT16)) ; port GPIO.A8
A9: U4.88(PK1_(ADC9/PCINT17)) ; port GPIO.A9
A10: U4.87(PK2_(ADC10/PCINT18)) ; port GPIO.A10
A11: U4.86(PK3_(ADC11/PCINT19)) ; port GPIO.A11
A12: U4.85(PK4_(ADC12/PCINT20)) ; port GPIO.A12
A13: U4.84(PK5_(ADC13/PCINT21)) ; port GPIO.A13
A14: U4.83(PK6_(ADC14/PCINT22)) ; port GPIO.A14
A15: U4.82(PK7_(ADC15/PCINT23)) ; port GPIO.A15
AREF: U4.98(AREF) ; sheet MCU_SUPPORT/AREF
AVCC: U4.100(AVCC) ; sheet MCU_SUPPORT/AVCC
D6: U4.15(PH3_(OC4A)) ; port GPIO.D6
D7: U4.16(PH4_(OC4B)) ; port GPIO.D7
D8: U4.17(PH5_(OC4C)) ; port GPIO.D8
D9: port GPIO.D9
D11: U4.24(PB5_(OC1A/PCINT5)) ; port GPIO.D11
D12: U4.25(PB6_(OC1B/PCINT6)) ; port GPIO.D12
D13: U4.26(PB7_(OC0A/OC1C/PCINT7)) ; port GPIO.D13
D42: U4.42(PL7) ; port GPIO.D42
D43: U4.41(PL6) ; port GPIO.D43
D44: U4.40(PL5_(OC5C)) ; port GPIO.D44
D45: U4.39(PL4_(OC5B)) ; port GPIO.D45
D46: U4.38(PL3_(OC5A)) ; port GPIO.D46
D47: U4.37(PL2_(T5)) ; port GPIO.D47
D48: U4.36(PL1_(ICP5)) ; port GPIO.D48
D49: U4.35(PL0_(ICP4)) ; port GPIO.D49
M1ENA: U4.72(PA6_(AD6)) ; port MCTL1.ENA  [project net MCTL1.ENA]
M1ENB: U4.71(PA7_(AD7)) ; port MCTL1.ENB  [project net MCTL1.ENB]
M1INA: U4.73(PA5_(AD5)) ; port MCTL1.INA  [project net MCTL1.INA]
M1INB: U4.70(PG2_(ALE)) ; port MCTL1.INB  [project net MCTL1.INB]
M1PWM: U4.5(PE3_(OC3A/AIN1)) ; port MCTL1.PWM  [project net MCTL1.PWM]
M1SENSE: U4.92(PF5_(ADC5/TMS)) ; port MCTL1.SENSE  [project net MCTL1.SENSE]
M2ENA: U4.58(PC5_(A13)) ; port MCTL2.ENA  [project net MCTL2.ENA]
M2ENB: U4.57(PC4_(A12)) ; port MCTL2.ENB  [project net MCTL2.ENB]
M2INA: U4.59(PC6_(A14)) ; port MCTL2.INA  [project net MCTL2.INA]
M2INB: U4.56(PC3_(A11)) ; port MCTL2.INB  [project net MCTL2.INB]
M2PWM: U4.6(PE4_(OC3B/INT4)) ; port MCTL2.PWM  [project net MCTL2.PWM]
M2SENSE: U4.91(PF6_(ADC6/TDO)) ; port MCTL2.SENSE  [project net MCTL2.SENSE]
M3ENA: U4.53(PC0_(A8)) ; port MCTL3.ENA  [project net MCTL3.ENA]
M3ENB: U4.52(PG1_(RD)) ; port MCTL3.ENB  [project net MCTL3.ENB]
M3INA: U4.54(PC1_(A9)) ; port MCTL3.INA  [project net MCTL3.INA]
M3INB: U4.51(PG0_(WR)) ; port MCTL3.INB  [project net MCTL3.INB]
M3PWM: U4.7(PE5_(OC3C/INT5)) ; port MCTL3.PWM  [project net MCTL3.PWM]
M3SENSE: U4.90(PF7_(ADC7/TDI)) ; port MCTL3.SENSE  [project net MCTL3.SENSE]
MISO: U4.22(PB3_(MISO/PCINT3)) ; port SPI.MISO  [project net SPI.MISO]
MOSI: U4.21(PB2_(MOSI/PCINT2)) ; port SPI.MOSI  [project net SPI.MOSI]
~{RESET}: U4.30(~{RESET}) ; port ~{RESET}
~{SS}: U4.19(PB0_(~{SS}/PCINT0)) ; port ~{SS}
~{SS}1: U4.74(PA4_(AD4)) ; port ~{SS}1
~{SS}2: U4.60(PC7_(A15)) ; port ~{SS}2
~{SS}3: U4.55(PC2_(A10)) ; port ~{SS}3
SBC_SHDN: U4.23(PB4_(OC2A/PCINT4)) ; port SBC_SHDN
SCK: U4.20(PB1_(SCK/PCINT1)) ; port SPI.SCK  [project net SPI.SCK]
SCL: U4.43(PD0_(SCL/INT0)) ; port I2C.SCL  [project net I2C.SCL]
SDA: U4.44(PD1_(SDA/INT1)) ; port I2C.SDA  [project net I2C.SDA]
SENSE_EN: U4.13(PH1_(TXD2)) ; port SENSE_EN
SPI_EN: U4.1(PG5_(OC0B)) ; port SPI_EN  [project net ~{OE}]
UART.RX: U4.2(PE0_(RXD0/PCINT8)) ; port UART.RX
UART.TX: U4.3(PE1_(TXD0)) ; port UART.TX
VBAT_VOLTAGE: U4.93(PF4_(ADC4/TCK)) ; port VBAT_VOLTAGE
XTAL1: U4.34(XTAL1) ; sheet MCU_SUPPORT/XTAL1
XTAL2: U4.33(XTAL2) ; sheet MCU_SUPPORT/XTAL2

Not connected (* = marked no-connect by the designer): U4 4(PE2_(XCK0/AIN0)) 8(PE6_(T3/INT6)) 9(PE7_(CLKO/ICP3/INT7)) 14(PH2_(XCK2)) 18(PH6_(OC2B)) 27(PH7_(T4)) 28(PG3_(TOSC2)) 29(PG4_(TOSC1)) 45(PD2_(RXD1/INT2)) 46(PD3_(TXD1/INT3)) 47(PD4_(ICP1)) 48(PD5_(XCK1)) 49(PD6_(T1)) 50(PD7_(T0)) 63(PJ0_(RXD3/PCINT9)) 64(PJ1_(TXD3/PCINT10)) 65(PJ2_(XCK3/PCINT11)) 66(PJ3_(PCINT12)) 67(PJ4_(PCINT13)) 68(PJ5_(PCINT14)) 69(PJ6_(PCINT15)) 75(PA3_(AD3)) 76(PA2_(AD2)) 77(PA1_(AD1)) 78(PA0_(AD0)) 79(PJ7)

### Notes on the sheet
- TIMER3
- UART
- D5
- NC
- D0
- D1
- A0
- A1
- A2
- A3
- D2
- D3
- A5
- A6
- A7
- A4
- TIMER4
- D6
- D7
- D17
- D16
- A8
- A9
- A10
- A11
- A12
- D8
- D53
- A13
- A14
- A15
- D22
- TIMER1
- D11
- D52
- D51
- D50
- D10
- D25
- D26
- D27
- D24
- D23
- D12
- D13
- D48
- D49
- D28
- D29
- TIMER5
- D44
- D45
- D46
- D47
- D43
- D14
- D21
- D20
- D19
- D42
- D30
- D31
- D32
- D15
- D38
- D18
- D33
- D34
- D35
- D36
- D37
- D39
- D4
- D40
- D41
- Title:
- Size:
- Letter
- Drawn By:
- Rev:
- Date:
- Time:
- Sheet
- /

### Library data of the parts
U4 = ATmega2560-16AU: 8-bit AVR Microcontroller, 4.5-5.5V, 16MHz, 256KB Flash, 4KB EEPROM, 8KB SRAM, 86 GPIO pins, 100-pin TQFP, Industrial Grade (-40°C to 85°C), Pb-Free; Manufacturer: Microchip / Atmel; Interface: 2-Wire,EBI/EMI,I2C,SPI,UART,USART; Data Bus Width: 8b; Number of I/Os: 86; Oscillator Type: Internal; Peripherals: Brown-out Detect/Reset,POR,PWM,WDT; Number of Timers/Counters: 6; Min Supply Voltage: 4.5V; Max Supply Voltage: 5.5V; Watchdog Timer: Yes; Operating Supply Voltage: 5V; Access Time: 16us; Number of PWM Channels: 12; Number of ADC Channels: 16; Number of SPI Channels: 1; Supplier 1: Digi-Key; Manufacturer Part Number: ATMEGA2560-16AU; Stock 1: 11396; Pricing 1: 1 = 12.21000, 25 = 11.18600, 100 = 10.13520 (USD); RoHS: Yes; Mount: Surface Mount; Case/Package: A; Number of Pins: 100; Number of Terminals: 100; Min Operating Temperature: -40°C; Max Operating Temperature: 85°C; Core Architecture: AVR; Package Quantity: 90; Packaging: Tray; Memory Size: 256KB; Frequency: 16MHz; Memory Type: FLASH; RAM Size: 8KB; Max Frequency: 16MHz; Number of Programmable I/O: 86; Density: 256KB; Number of I2C Channels: 1; Termination: SMD/SMT; Length: 14.1mm; Height: 1.05mm; Width: 14.1mm; Radiation Hardening: No; Lead Free: Lead Free; REACH SVHC: No SVHC; ComponentLink1URL: http://www.farnell.com/datasheets/2013645.pdf?src-supplier=Element14; ComponentLink1Description: http://www.farnell.com/datasheets/2013645.pdf?src-supplier=Element14; ComponentLink2URL: http://www.farnell.com/datasheets/1817551.pdf?src-supplier=Verical; ComponentLink2Description: http://www.farnell.com/datasheets/1817551.pdf?src-supplier=Verical; ComponentLink3URL: http://www.microchip.com/mymicrochip/filehandler.aspx?ddocname=en589901&src-supplier=Digi-Key; ComponentLink3Description: http://www.microchip.com/mymicrochip/filehandler.aspx?ddocname=en589901&src-supplier=Digi-Key; ComponentLink4URL: http://www.farnell.com/datasheets/33246.pdf?src-supplier=Farnell; ComponentLink4Description: http://www.farnell.com/datasheets/33246.pdf?src-supplier=Farnell; ComponentLink5URL: http://www.alliedelec.com/images/products/datasheets/bm/ATMEL/70123980.pdf?src-supplier=Allied+Electronics; ComponentLink5Description: http://www.alliedelec.com/images/products/datasheets/bm/ATMEL/70123980.pdf?src-supplier=Allied+Electronics; ComponentLink6URL: http://www.farnell.com/datasheets/1698622.pdf?src-supplier=Farnell; ComponentLink6Description: http://www.farnell.com/datasheets/1698622.pdf?src-supplier=Farnell; ComponentLink7URL: http://datasheet.iiic.cc/atmel/ATMEGA2560-16AU.pdf?src-supplier=IIIC; ComponentLink7Description: http://datasheet.iiic.cc/atmel/ATMEGA2560-16AU.pdf?src-supplier=IIIC; ComponentLink8URL: http://www.produktinfo.conrad.com/datenblaetter/150000-174999/154804-da-01-en-ATMEGA2560_16AU_TQFP_100.pdf?src-supplier=Conrad; ComponentLink8Description: http://www.produktinfo.conrad.com/datenblaetter/150000-174999/154804-da-01-en-ATMEGA2560_16AU_TQFP_100.pdf?src-supplier=Conrad; Supplier Part Number 1: ATMEGA2560-16AU-ND; Pin Count: 100

## Sheet Microcontroller Support.SchDoc: Microcontroller Support
size 228 x 165 mm; DrawnBy: Joseph Riesen; DocumentNumber: 3; Revision: 1.0; SheetNumber: 3; SheetTotal: 10
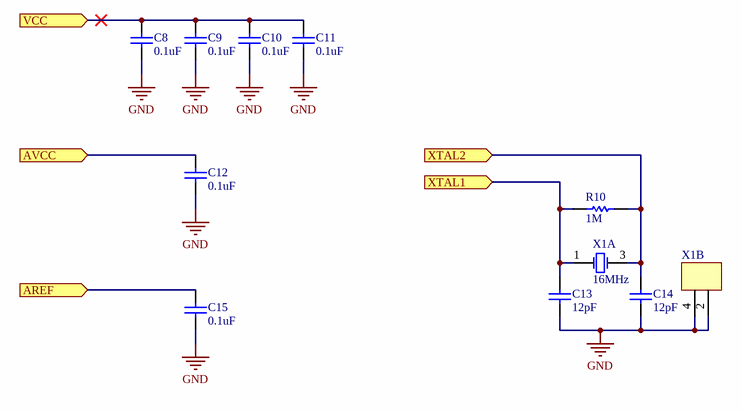
[diagram p6: Microcontroller Support.SchDoc]

### Parts
C8  0.1uF  [CAPC0805(2012)100_M]
C9  0.1uF  [CAPC0805(2012)100_M]
C10  0.1uF  [CAPC0805(2012)100_M]
C11  0.1uF  [CAPC0805(2012)100_M]
C12  0.1uF  [CAPC0805(2012)100_M]
C13  12pF  [CAPC1608X87X35ML15T15]
C14  12pF  [CAPC1608X87X35ML15T15]
C15  0.1uF  [CAPC0805(2012)100_M]
R10  1M  [RESC2013X70X40NL20T20]
X1  16MHz  [DFN220P320X80-4M]  (parts A,B of 2)

### Ports
AREF (in), AVCC (in), VCC (in), XTAL1 (in), XTAL2 (in)

### Nets
+5VLO: C8.2 C9.2 C10.2 C11.2 ; port VCC
GND: C8.1 C9.1 C10.1 C11.1 C12.1 C13.1 C14.1 C15.1 X1.2(GND) X1.4(GND)
AREF: C15.2 ; port AREF
AVCC: C12.2 ; port AVCC
XTAL1: C13.2 R10.2 X1.1(X1) ; port XTAL1
XTAL2: C14.2 R10.1 X1.3(X2) ; port XTAL2

### Notes on the sheet
- Title:
- Size:
- Letter
- Drawn By:
- Rev:
- Date:
- Time:
- Sheet
- /

### Library data of the parts
C8-C12 C15 = CMP-1036-04391-1: as C16 on sheet Motor Driver and Encoder; Rated Voltage: 6.3 V; Technology: SMT; Value: 100nF; Max Thickness: 1 mm; ClassName: =ComponentClassName
C13 C14 = CMP-2006-03475-1: as C17 on sheet Motor Driver and Encoder; ClassName: =ComponentClassName
R10 = CMP-1665-00012-4: as R11 on sheet Motor Driver and Encoder; ComponentLink2URL: http://industrial.panasonic.com/cdbs/www-data/pdf/RDA0000/AOA0000C86.pdf; PackageReference: 0805; Min Operating Temperature: -55 degC; RoHSCompliant: true; Package Quantity: 5000; ComponentLink1URL: http://www.panasonic.com/; Pins: 2; Height: 0.6 mm; Packaging: Tape and Reel; ComponentLink2Description: Datasheet; ComponentLink1Description: Manufacturer URL; Mounting Technology: Surface Mount; REACH SVHC: Yes; Mount: Surface Mount; PackageDescription: 2-Pin Surface Mount Device, Body 2 x 1.25 mm; DatasheetVersion: 04/2015; Max Operating Temperature: 155 degC; Length: 2 mm; ClassName: =ComponentClassName
X1 = FC3BACAGI16.0-T3: CRYSTAL16MHZ 12PF SMD; Manufacturer: Fox Electronics; Supplier 1: Digi-Key; Manufacturer Part Number: FC3BACAGI16.0-T3; Stock 1: 2804; Pricing 1: 1 = 0.510000, 10 = 0.422000, 50 = 0.379400, 100 = 0.337300, 500 = 0.320400, 1000 = 0.269810 (USD); RoHS 1: No; Supplier Part Number 1: 631-1490-1-ND; ComponentLink1Description: Datasheet; ComponentLink1URL: http://www.foxonline.com/pdfs/C3BA.pdf; ClassName: =ComponentClassName

## Sheet SBC Interface.SchDoc: Single Board Computer Interface
size 228 x 165 mm; DrawnBy: Joseph Riesen; DocumentNumber: 8; Revision: 1.0; SheetNumber: 8; SheetTotal: 10
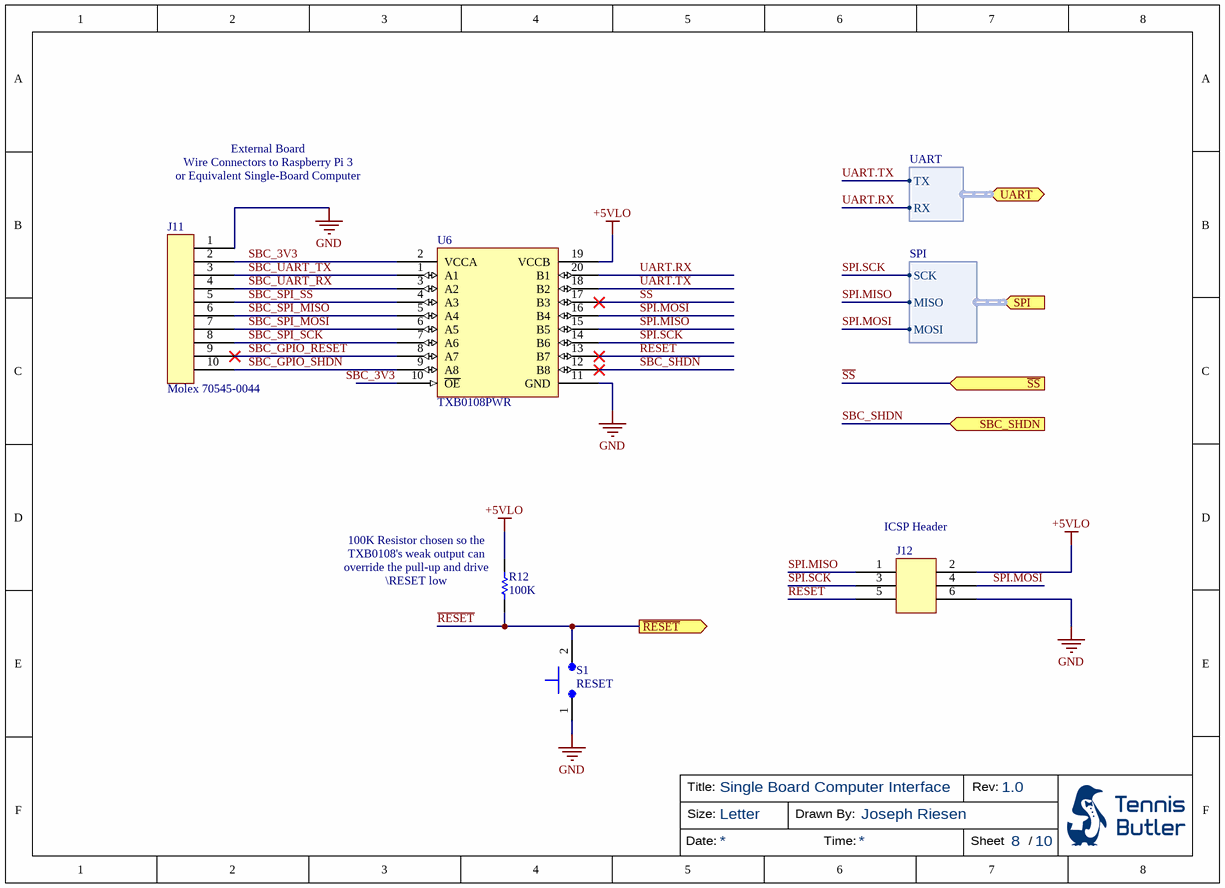
[diagram p7: SBC Interface.SchDoc]

### Parts
J11  Molex 70545-0044  [Molex 70545-0044]
J12  ICSP  [Molex 70287-1099]  (value not drawn)
R12  100K  [RESC2013X70X40ML20T20]
S1  RESET  [E-Switch TL9210 Series Tact Switch]
U6  TXB0108PWR  [TSOP65P640X120-20M]

### Ports
SBC_SHDN (in), SPI (in, harness SPI), UART (bidir, harness UART), ~{RESET} (out), ~{SS} (in)

### Harnesses
SPI: MISO, MOSI, SCK
UART: TX, RX

### Nets
+5VLO: J12.2 R12.2 U6.19(VCCB)
GND: J11.1 J12.6 S1.1 U6.11(GND)
~{RESET}: J12.5 R12.1 S1.2 U6.13(B7) ; port ~{RESET}
~{SS}: U6.17(B3) ; port ~{SS}
SBC_3V3: J11.2 U6.2(VCCA) U6.10(~{OE})
SBC_GPIO_RESET: J11.9 U6.8(A7)
SBC_GPIO_SHDN: J11.10 U6.9(A8)
SBC_SHDN: U6.12(B8) ; port SBC_SHDN
SBC_SPI_MISO: J11.6 U6.5(A4)
SBC_SPI_MOSI: J11.7 U6.6(A5)
SBC_SPI_SCK: J11.8 U6.7(A6)
SBC_SPI_SS: J11.5 U6.4(A3)
SBC_UART_RX: J11.4 U6.3(A2)
SBC_UART_TX: J11.3 U6.1(A1)
SPI.MISO: J12.1 U6.15(B5) ; port SPI.MISO
SPI.MOSI: J12.4 U6.16(B4) ; port SPI.MOSI
SPI.SCK: J12.3 U6.14(B6) ; port SPI.SCK
UART.RX: U6.20(B1) ; port UART.RX
UART.TX: U6.18(B2) ; port UART.TX

### Notes on the sheet
- External Board
  Wire Connectors to Raspberry Pi 3
  or Equivalent Single-Board Computer
- (near J12) ICSP Header
- (near R12) 100K Resistor chosen so the TXB0108's weak output can override the pull-up and drive \RESET low
- Title:
- Size:
- Letter
- Drawn By:
- Rev:
- Date:
- Time:
- Sheet
- /

### Library data of the parts
J11 = Molex 70545-0044 SL 10-Pin Header: CONN HEADER VERT 10POS 2.54MM, PEG; Contact Resistance: 30mR; Number of Positions: 10; Current Rating: 3A; Voltage Rating: 250V; Insulation Resistance: 1GR; Gender: Female; Glow Wire Compliant: Non-compliant; Supplier 1: Digi-Key; Manufacturer: Molex; Manufacturer Part Number: 70545-0044; Stock 1: 559; Pricing 1: 1 = 2.16000, 10 = 1.96000, 100 = 1.68000, 500 = 1.40000, 1000 = 1.20000, 5000 = 1.06400 (USD); RoHS 1: Yes; Mount: Through Hole; Contact Material: Bronze; Contact Plating: Gold; Housing Material: Thermoplastic; Color: Black; Material: Brass; Min Operating Temperature: -40°C; Max Operating Temperature: 105°C; Number of Rows: 1; Packaging: Rail/Tube; Termination: Through Hole; Number of Contacts: 10; Orientation: Vertical; Package Quantity: 768; Contact Gender: Male; Number of Circuits: 10; Voltage Rating (DC): 250V; Pitch: 2.54mm; REACH SVHC: Unknown; ELV: Compliant; Flammability Rating: UL94 V-0; ComponentLink1URL: https://datasheet.ciiva.com/5159/0705450044-pcb-headers-172681-5159521.pdf?src-supplier=Mouser; ComponentLink1Description: Datasheet 1 (Mouser); ComponentLink2URL: https://datasheet.ciiva.com/30114/22600705450044-pcb-headers-30114382.pdf?src-supplier=Onlinecomponents.com; ComponentLink2Description: Datasheet 2 (Onlinecomponents.com); Supplier Part Number 1: WM4150-ND
J12 = Molex 70287-1099 6-Pin (3x2) Male Header: CONN HEADER BKWY DL GOLD 6POS; Manufacturer: Molex; Manufacturer Part Number: 0702871099; Number of Positions: 6; Max Voltage Rating (DC): 250V; Connector Type: Male Pin; Pitch: 2.54mm; Row Spacing: 0.1inch; Supplier 1: Digi-Key; Stock 1: 0; RoHS 1: Yes; Mount: Through Hole; Contact Plating: Gold; Contact Material: Brass; Housing Material: Thermoplastic; Color: Black; Housing Color: Black; Min Operating Temperature: -40°C; Max Operating Temperature: 120°C; Orientation: Straight; Packaging: Bulk; Number of Rows: 2; Termination: Solder; Number of Contacts: 6; Length: 7.62mm; Contact Mating Length: 0.24inch; Depth: 5.08mm; Radiation Hardening: No; ComponentLink1URL: https://datasheet.ciiva.com/9470/0702871099-pcb-headers-9470351.pdf?src-supplier=Avnet; ComponentLink1Description: Datasheet 1 (Avnet); ComponentLink2URL: https://datasheet.ciiva.com/2961/702871098-sd-2961401.pdf?src-supplier=Digi-Key; ComponentLink2Description: Datasheet 2 (Digi-Key); Supplier Part Number 1: 0702871099-ND
R12 = CMP-2001-04377-1: as R7 on sheet High-Current Power Supply
S1 = E-Switch TL9210 Series Tact Switch: SWITCH TACTILE SPST-NO 0.05A 12V; Manufacturer Part Number: TL9210AF260Q; Mechanical Life: 100000Cycles; Illumination Type: Non-Illuminated; Operating Force: 260gf; Throw Configuration: SPST; Switch Travel: 1.3mm; Switch Function: Off-Mom; Supplier 1: Digi-Key; Manufacturer: E-Switch; Stock 1: 4135; Pricing 1: 1 = 0.59000, 10 = 0.56400, 25 = 0.55400, 50 = 0.53300, 100 = 0.45980, 250 = 0.41804, 500 = 0.39712 (USD); RoHS 1: Yes; Mount: Surface Mount; Min Operating Temperature: -20°C; Max Operating Temperature: 70°C; Packaging: Tape and Reel; Termination: Gull Wing; Lead Free: Lead Free; ComponentLink1URL: http://www.mouser.com/ds/2/140/e-switch_TL9210-371502.pdf?src-supplier=Mouser; ComponentLink1Description: Datasheet 1 (Mouser); ComponentLink2URL: https://media.digikey.com/pdf/Data%20Sheets/E-Switch%20PDFs/TL9210.pdf?src-supplier=Digi-Key; ComponentLink2Description: Datasheet 2 (Digi-Key); Supplier Part Number 1: EG2664CT-ND
U6 = TXB0108PWR: IC, TRANSLATOR, 8BIT, BIDIRECTIONAL; Manufacturer: Texas Instruments; Max Supply Voltage: 5.5V; Min Supply Voltage: 1.65V; Propagation Delay: 4ns; Number of Channels: 8; High Level Output Current: -20uA; Low Level Output Current: 20uA; Data Rate: 100Mbps; Turn-On Delay Time: 9.5ns; Quiescent Current: 3.5uA; Rise Time: 7.3ns; Supplier 1: Digi-Key; Manufacturer Part Number: TXB0108PWR; Stock 1: 47771; Pricing 1: 1 = 1.55000, 10 = 1.39200, 100 = 1.11890, 500 = 0.91928, 1000 = 0.76169 (USD); RoHS 1: Yes; Mount: Surface Mount; Case/Package: TSSOP; Number of Pins: 20; Weight: 0.002716oz; Contact Plating: Gold; Min Operating Temperature: -40°C; Max Operating Temperature: 85°C; Packaging: Tape and Reel; Package Quantity: 1; Logic Function: Translator; Number of Bits: 8; Number of Inputs: 8; Output Current: 20uA; Termination: SMD/SMT; Length: 6.5mm; Height: 1.15mm; Width: 4.4mm; Radiation Hardening: No; Lead Free: Lead Free; REACH SVHC: No SVHC; ComponentLink1Description: Datasheet; ComponentLink1URL: http://www.ti.com/lit/ds/symlink/txb0108.pdf; Supplier Part Number 1: 296-21527-1-ND